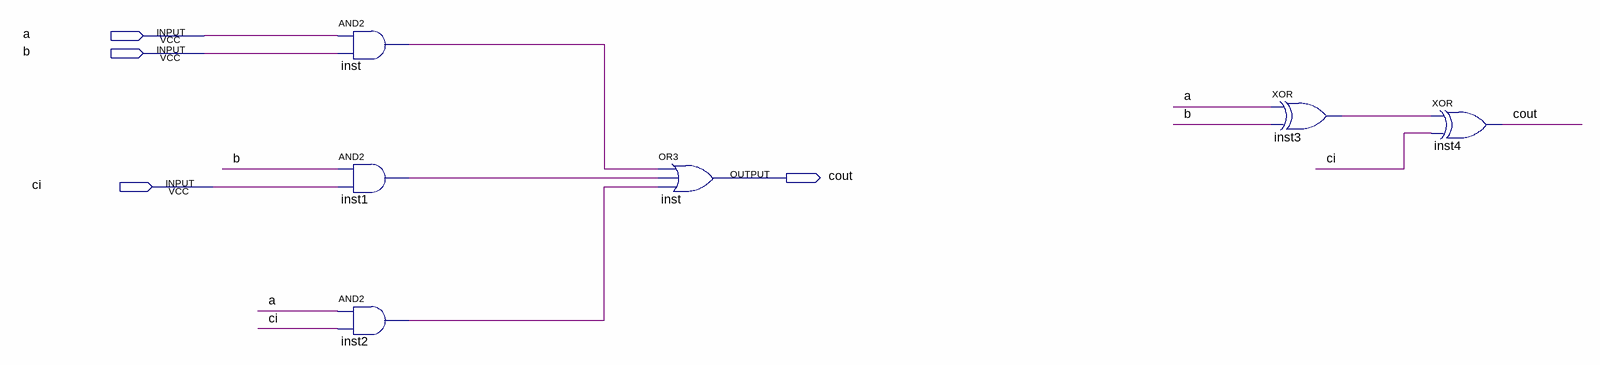
[diagram p0: schematic sheet]
// Quartus schematic Addsub4.bdf as structural Verilog: 6 symbols, 4 pins
module Addsub4 (
  input  a,
  input  b,
  input  ci,
  output cout
);

  wire inst1_out, inst2_out, inst3_out, inst_out;

  and inst (inst_out, a, b);
  and inst1 (inst1_out, b, ci);
  and inst2 (inst2_out, a, ci);
  or inst_dup2 (cout, inst_out, inst1_out, inst2_out);
  xor inst3 (inst3_out, a, b);
  xor inst4 (cout, inst3_out, ci);
endmodule
